# Altium schematic sheet motor_driver_interface.SchDoc
size A4
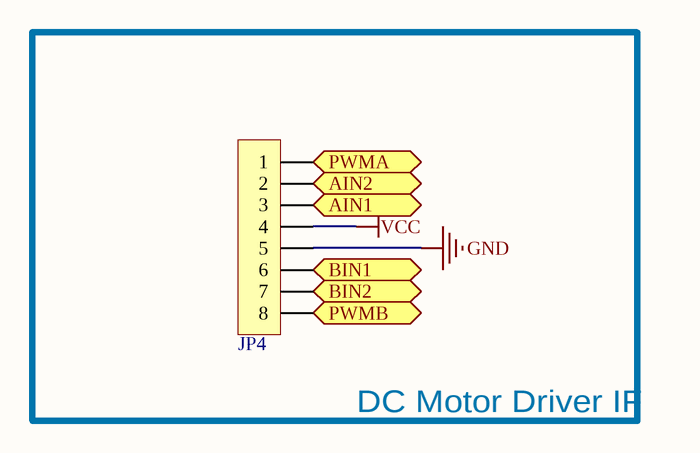
[diagram p0: motor_driver_interface.SchDoc]

## Parts
JP4  HDR-1X8  [XH2.54-LI-8P]  (value not drawn)

## Blocks framed on the sheet
DC Motor Driver IF: JP4

## Ports
AIN1 (bidir), AIN2 (bidir), BIN1 (bidir), BIN2 (bidir), PWMA (bidir), PWMB (bidir)

## Nets
GND: JP4.5
VCC: JP4.4
AIN1: JP4.3 ; port AIN1
AIN2: JP4.2 ; port AIN2
BIN1: JP4.6 ; port BIN1
BIN2: JP4.7 ; port BIN2
PWMA: JP4.1 ; port PWMA
PWMB: JP4.8 ; port PWMB

## Library data of the parts
JP4 = Header 8: 8P接插件; 版权归属: 源创客; BOM名称: 8P接插件; 学习资源: www.ooocke.com